# EAGLE design Sur control (EAGLE 8.7.0)
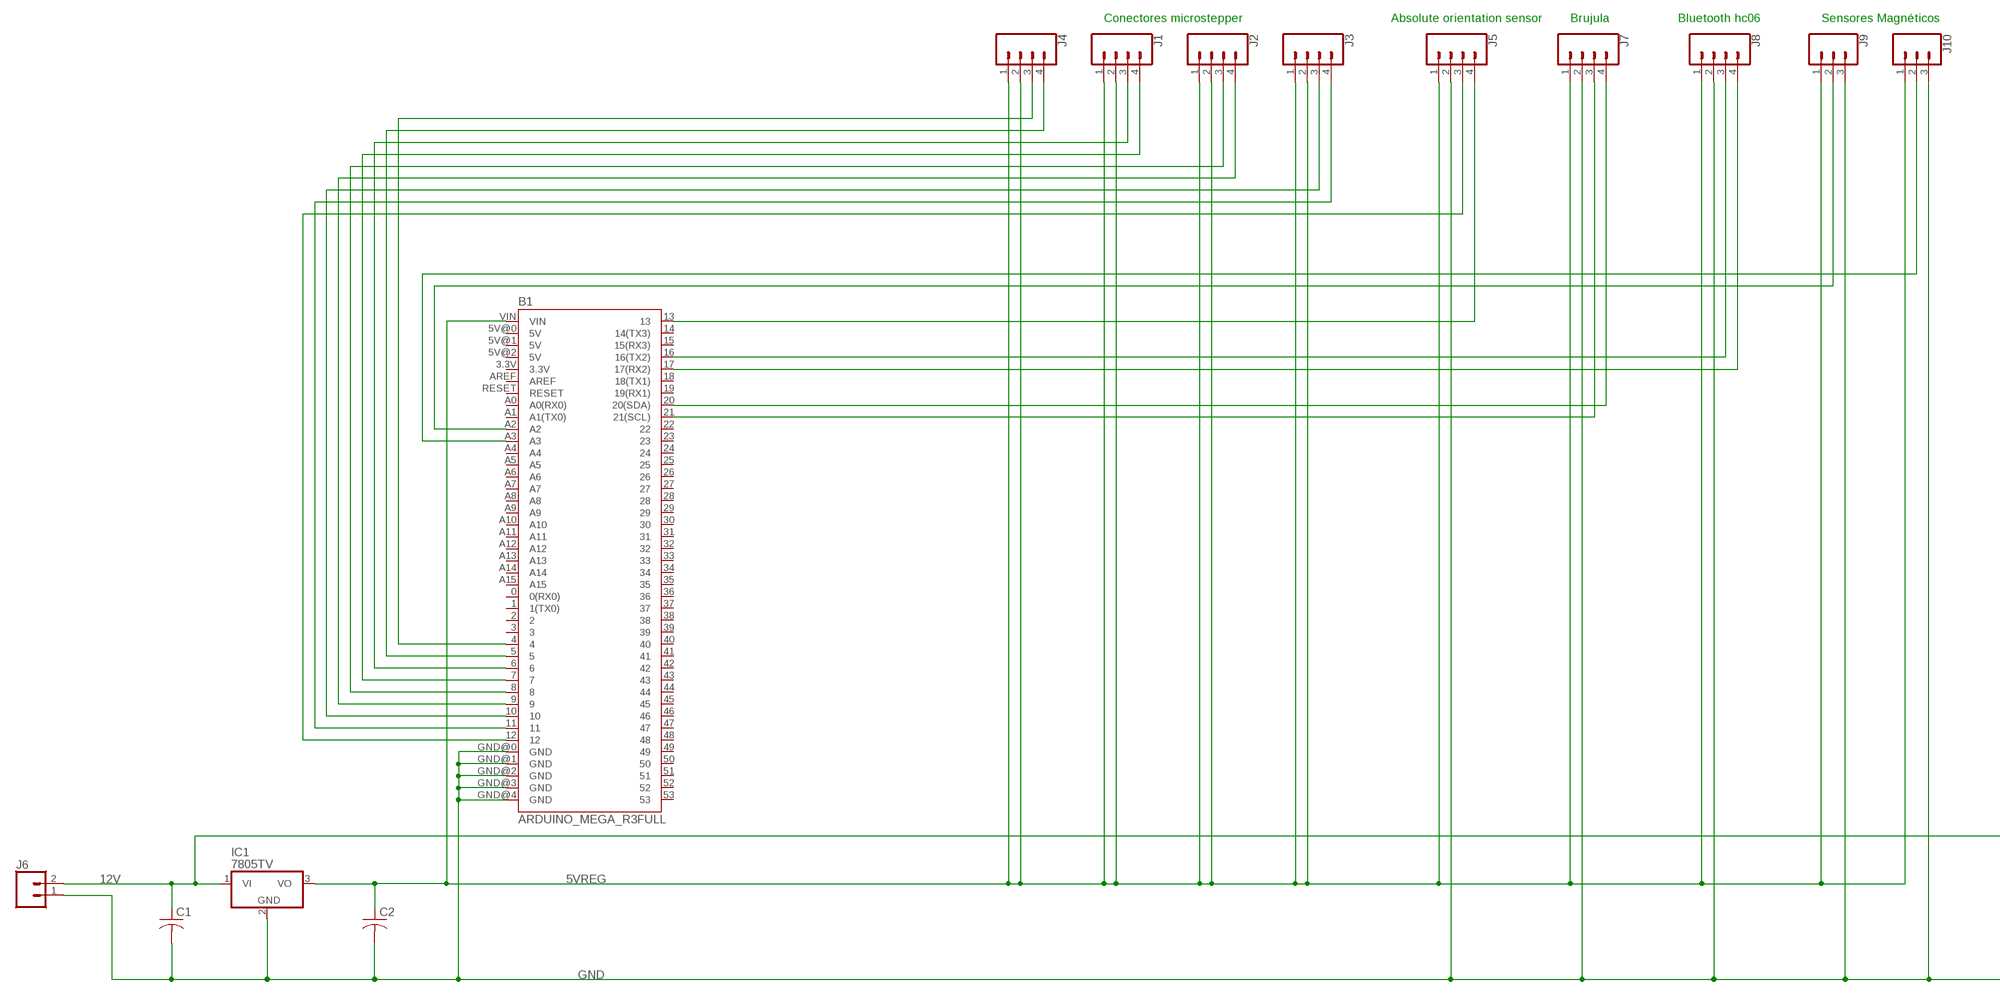
[diagram p0: schematic, sheet 1, part 1 of 2]
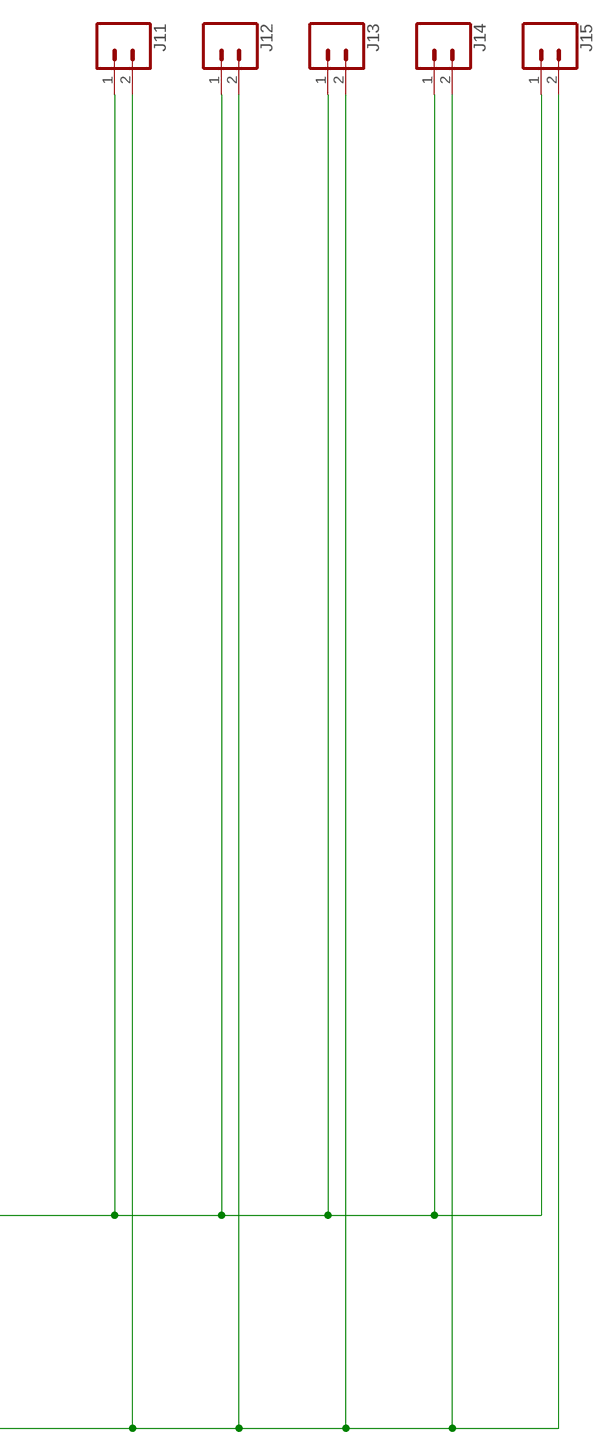
[diagram p1: schematic, sheet 1, part 2 of 2]

## Parts
B1  ARDUINO_MEGA_R3FULL  [ARDUINO_MEGA]
C1  C-US050-025X075  [C050-025X075]
C2  C-US050-025X075  [C050-025X075]
IC1  7805TV  [TO220V]
J1  CONN_04SCREW_LOCK  [SCREWTERMINAL-3.5MM-4_LOCK]
J2  CONN_04SCREW_LOCK  [SCREWTERMINAL-3.5MM-4_LOCK]
J3  CONN_04SCREW_LOCK  [SCREWTERMINAL-3.5MM-4_LOCK]
J4  CONN_04SCREW_LOCK  [SCREWTERMINAL-3.5MM-4_LOCK]
J5  CONN_04SCREW_LOCK  [SCREWTERMINAL-3.5MM-4_LOCK]
J6  CONN_023.5MM_LOCK  [SCREWTERMINAL-3.5MM-2_LOCK]
J7  CONN_04SCREW_LOCK  [SCREWTERMINAL-3.5MM-4_LOCK]
J8  CONN_04SCREW_LOCK  [SCREWTERMINAL-3.5MM-4_LOCK]
J9  CONN_03SCREW_LOCK  [SCREWTERMINAL-3.5MM-3_LOCK.007S]
J10  CONN_03SCREW_LOCK  [SCREWTERMINAL-3.5MM-3_LOCK.007S]
J11  CONN_023.5MM_LOCK  [SCREWTERMINAL-3.5MM-2_LOCK]
J12  CONN_023.5MM_LOCK  [SCREWTERMINAL-3.5MM-2_LOCK]
J13  CONN_023.5MM_LOCK  [SCREWTERMINAL-3.5MM-2_LOCK]
J14  CONN_023.5MM_LOCK  [SCREWTERMINAL-3.5MM-2_LOCK]
J15  CONN_023.5MM_LOCK  [SCREWTERMINAL-3.5MM-2_LOCK]

## Nets
5VREG: B1.VIN C2.1 IC1.3(VO) J1.1 J1.2 J2.1 J2.2 J3.1 J3.2 J4.1 J4.2 J5.1 J7.1 J8.1 J9.1 J10.1
12V: C1.1 IC1.1(VI) J6.2 J11.1 J12.1 J13.1 J14.1 J15.1
GND: B1.GND@0(GND) B1.GND@1(GND) B1.GND@2(GND) B1.GND@3(GND) B1.GND@4(GND) C1.2 C2.2 IC1.2(GND) J5.2 J6.1 J7.2 J8.2 J9.3 J10.3 J11.2 J12.2 J13.2 J14.2 J15.2
N$1: B1.21(21(SCL)) J7.3
N$2: B1.20(20(SDA)) J7.4
N$4: B1.4 J4.3
N$5: B1.5 J4.4
N$6: B1.6 J1.3
N$7: B1.7 J1.4
N$8: B1.8 J2.3
N$9: B1.9 J2.4
N$10: B1.10 J3.3
N$11: B1.11 J3.4
N$12: B1.12 J5.3
N$13: B1.13 J5.4
N$16: B1.16(16(TX2)) J8.3
N$17: B1.17(17(RX2)) J8.4
N$18: B1.A2 J9.2
N$19: B1.A3 J10.2
Unconnected: B1.0(0(RX0)) B1.1(1(TX0)) B1.2 B1.3 B1.3.3V B1.5V@0(5V) B1.5V@1(5V) B1.5V@2(5V) B1.14(14(TX3)) B1.15(15(RX3)) B1.18(18(TX1)) B1.19(19(RX1)) B1.22 B1.23 B1.24 B1.25 B1.26 B1.27 B1.28 B1.29 B1.30 B1.31 B1.32 B1.33 B1.34 B1.35 B1.36 B1.37 B1.38 B1.39 B1.40 B1.41 B1.42 B1.43 B1.44 B1.45 B1.46 B1.47 B1.48 B1.49 B1.50 B1.51 B1.52 B1.53 B1.A0(A0(RX0)) B1.A1(A1(TX0)) B1.A4 B1.A5 B1.A6 B1.A7 B1.A8 B1.A9 B1.A10 B1.A11 B1.A12 B1.A13 B1.A14 B1.A15 B1.AREF B1.RESET

## Notes on the sheet
- Conectores microstepper | Absolute orientation sensor | Brujula | Bluetooth hc06 | Sensores Magnéticos

## Library data of the parts
B1 = SparkFun-Boards:ARDUINO_MEGA_R3: Arduino Mega R3 ATmega2560 R3 compatible footprint. SparkFun Products: Arduino Mega 2560 R3 <https://www.sparkfun.com/products/11061>
C1 C2 = rcl:C-US: CAPACITOR, American symbol; SPICEPREFIX: C
IC1 = linear:78*: Positive VOLTAGE REGULATOR Source: http://cache.national.com/ds/LM/LM78L05.pdf http://www.fairchildsemi.com/ds/LM/LM7805.pdf
J1-J5 J7 J8 = SparkFun-Connectors:CONN_04: Multi connection point. Often used as Generic Header-pin footprint for 0.1 inch spaced/style header connections On any of the 0.1 inch spaced packages, you can populate with these: Break Away Headers - Straight <https://www.sparkfun.com/products/116> (PRT-00116) Break Away Male Headers - Right Angle <https://www.sparkfun.com/products/553> (PRT-00553) Female Headers <https://www.sparkfun.com/products/115> (PRT-00115) Break Away Headers - Machine Pin <https://www.sparkfun.com/products/117> (PRT-00117) Break Away Female Headers - Swiss Machine Pin <https://www.sparkfun.com/products/743> (PRT-00743) For SCREWTERMINALS and SPRING TERMINALS visit here: Screw Terimnals on SparkFun.com <https://www.sparkfun.com/search/results?term=Screw+Terminals> (5mm/3.5mm/2.54mm spacing) This device is also useful as a general connection point to wire up your design to another part of your project. Our various solder wires solder well into these plated through hole pads. Hook-Up Wire - Assortment (Stranded, 22 AWG) <https://www.sparkfun.com/products/11375> (PRT-11375) Hook-Up Wire - Assortment (Solid Core, 22 AWG) <https://www.sparkfun.com/products/11367> (PRT-11367) View the entire wire category on our website here <https://www.sparkfun.com/categories/141> Special notes: Molex polarized connector foot print use with SKU : PRT-08231 with associated crimp pins and housings. 1MM SMD Version SKU: PRT-10208
J6 J11-J15 = SparkFun-Connectors:CONN_02: Multi connection point. Often used as Generic Header-pin footprint for 0.1 inch spaced/style header connections On any of the 0.1 inch spaced packages, you can populate with these: Break Away Headers - Straight <https://www.sparkfun.com/products/116> (PRT-00116) Break Away Male Headers - Right Angle <https://www.sparkfun.com/products/553> (PRT-00553) Female Headers <https://www.sparkfun.com/products/115> (PRT-00115) Break Away Headers - Machine Pin <https://www.sparkfun.com/products/117> (PRT-00117) Break Away Female Headers - Swiss Machine Pin <https://www.sparkfun.com/products/743> (PRT-00743) For SCREWTERMINALS and SPRING TERMINALS visit here: Screw Terimnals on SparkFun.com <https://www.sparkfun.com/search/results?term=Screw+Terminals> (5mm/3.5mm/2.54mm spacing) This device is also useful as a general connection point to wire up your design to another part of your project. Our various solder wires solder well into these plated through hole pads. Hook-Up Wire - Assortment (Stranded, 22 AWG) <https://www.sparkfun.com/products/11375> (PRT-11375) Hook-Up Wire - Assortment (Solid Core, 22 AWG) <https://www.sparkfun.com/products/11367> (PRT-11367) View the entire wire category on our website here <https://www.sparkfun.com/categories/141> Special notes: Molex polarized connector foot print use with: PRT-08233 with associated crimp pins and housings. 2.54_SCREWTERM for use with PRT-10571. 3.5mm Screw Terminal footprints for PRT-08084 5mm Screw Terminal footprints for use with PRT-08432; PROD_ID: CONN-08399
J9 J10 = SparkFun-Connectors:CONN_03: Multi connection point. Often used as Generic Header-pin footprint for 0.1 inch spaced/style header connections On any of the 0.1 inch spaced packages, you can populate with these: Break Away Headers - Straight <https://www.sparkfun.com/products/116> (PRT-00116) Break Away Male Headers - Right Angle <https://www.sparkfun.com/products/553> (PRT-00553) Female Headers <https://www.sparkfun.com/products/115> (PRT-00115) Break Away Headers - Machine Pin <https://www.sparkfun.com/products/117> (PRT-00117) Break Away Female Headers - Swiss Machine Pin <https://www.sparkfun.com/products/743> (PRT-00743) Stackable Header - 3 Pin (Female, 0.1") <https://www.sparkfun.com/products/13875> (PRT-13875) For SCREWTERMINALS and SPRING TERMINALS visit here: Screw Terimnals on SparkFun.com <https://www.sparkfun.com/search/results?term=Screw+Terminals> (5mm/3.5mm/2.54mm spacing) This device is also useful as a general connection point to wire up your design to another part of your project. Our various solder wires solder well into these plated through hole pads. Hook-Up Wire - Assortment (Stranded, 22 AWG) <https://www.sparkfun.com/products/11375> (PRT-11375) Hook-Up Wire - Assortment (Solid Core, 22 AWG) <https://www.sparkfun.com/products/11367> (PRT-11367) View the entire wire category on our website here <https://www.sparkfun.com/categories/141> Special notes: Molex polarized connector foot print use with SKU : PRT-08232 with associated crimp pins and housings.; PROD_ID: CONN-08288; SF_ID: PRT-08235

## Board
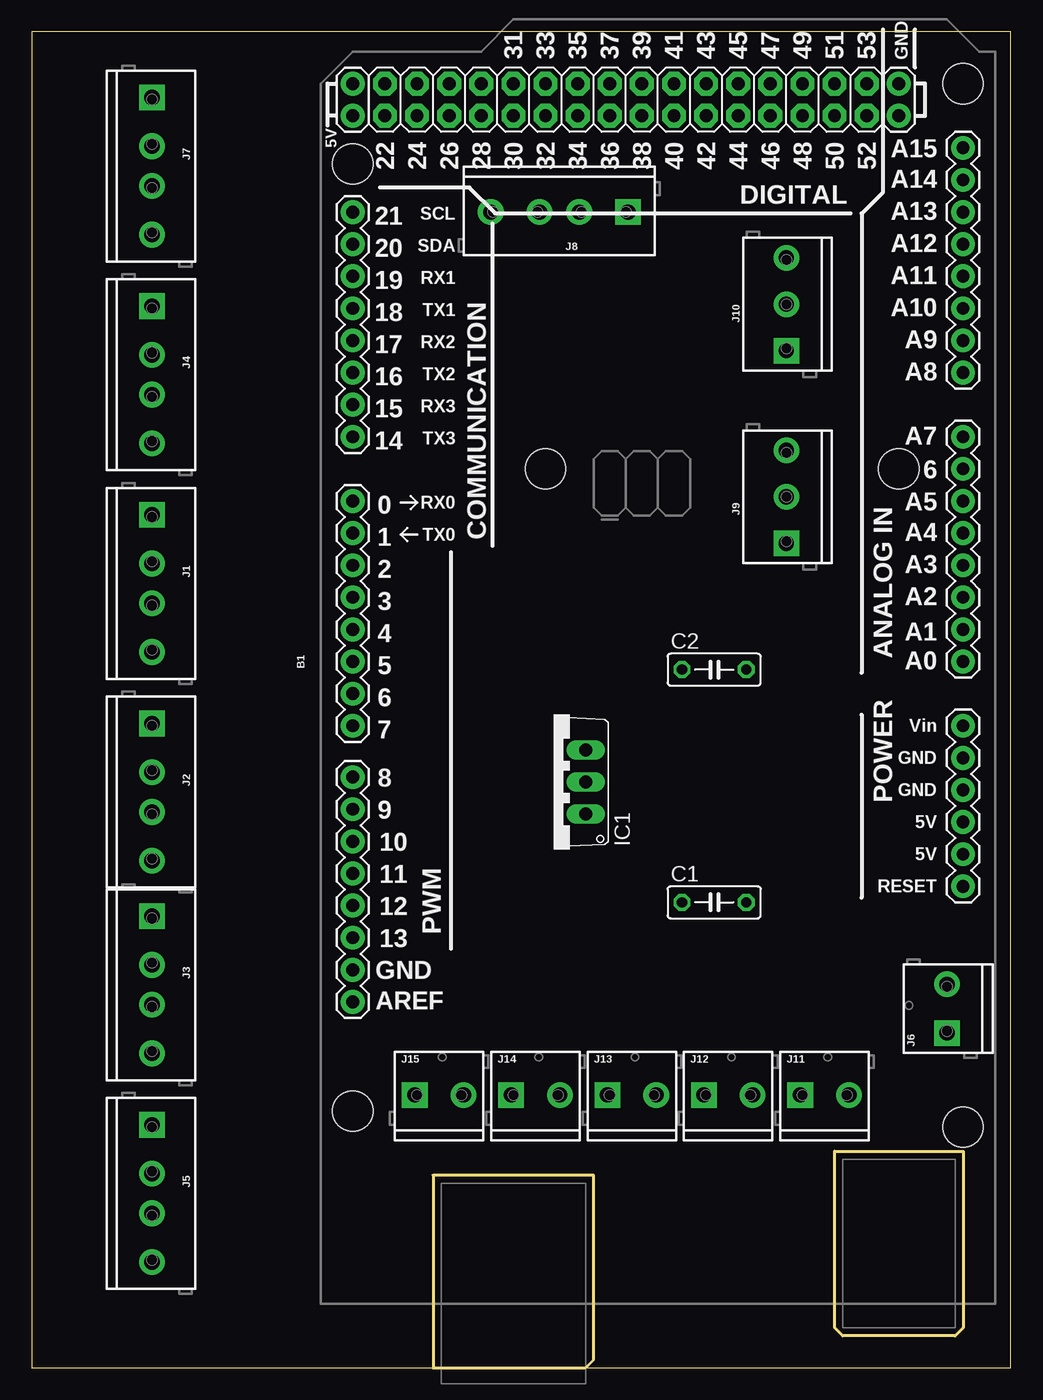
[diagram p2: board, top side]
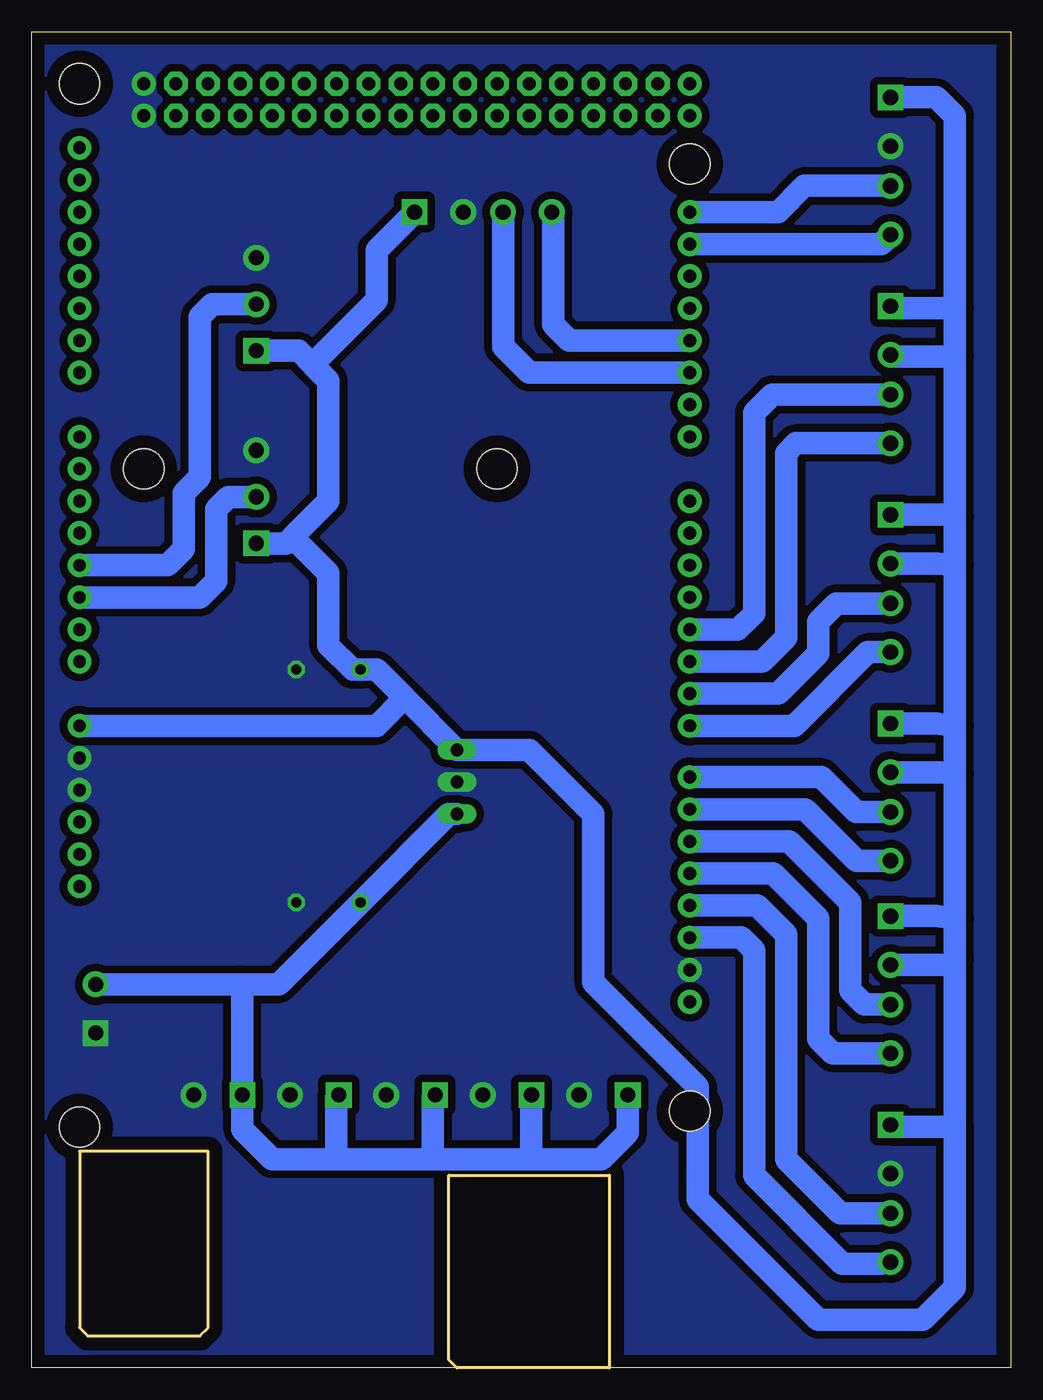
[diagram p3: board, bottom side, seen from below]

Size 77.45 x 105.72 mm. Coordinates in mm from the lower left corner, seen from the top.
Outline: 0,0 77.45,0 77.45,105.72 0,105.72 0,0
Copper layers (1*16): Top 0.035mm / dielectric 1.5mm / Bottom 0.035mm
Design rules "default": minimum track width 6mil, minimum drill 0.35mm, track to track 6mil, track to pad 6mil, pad to pad 6mil, via to via 6mil, smd to smd 6mil, copper to edge 40mil, drill to drill 6mil, minimum pad ring 10mil, minimum via ring 8mil, stop-mask expansion 4mil, vias tented up to drill 0mil, thermal gap 10mil

### Footprints (pad centres in the part's own frame; a part is rotated, then mirrored left to right if it is on the bottom)
ARDUINO_MEGA = drill 1.016 pad 1.88: 0 13.97,24.13; 1 11.43,24.13; 2 8.89,24.13; 3 6.35,24.13; 3.3V -13.97,-24.13; 4 3.81,24.13; 5 1.27,24.13; 5V@0 -11.43,-24.13; 5V@1 44.45,24.13; 5V@2 46.99,24.13; 6 -1.27,24.13; 7 -3.81,24.13; 8 -7.874,24.13; 9 -10.414,24.13; 10 -12.954,24.13; 11 -15.494,24.13; 12 -18.034,24.13; 13 -20.574,24.13; 14 19.05,24.13; 15 21.59,24.13; 16 24.13,24.13; 17 26.67,24.13; 18 29.21,24.13; 19 31.75,24.13; 20 34.29,24.13; 21 36.83,24.13; A0 1.27,-24.13; A1 3.81,-24.13; A2 6.35,-24.13; A3 8.89,-24.13; A4 11.43,-24.13; A5 13.97,-24.13; A6 16.51,-24.13; A7 19.05,-24.13; A8 24.13,-24.13; A9 26.67,-24.13; A10 29.21,-24.13; A11 31.75,-24.13; A12 34.29,-24.13; A13 36.83,-24.13; A14 39.37,-24.13; A15 41.91,-24.13; AREF -25.654,24.13; GND@0 -8.89,-24.13; GND@1 -6.35,-24.13; GND@2 44.45,-19.05; GND@3 46.99,-19.05; GND@4 -23.114,24.13; RESET -16.51,-24.13; VIN -3.81,-24.13 | drill 1.016 pad 1.88 octagon: 22 44.45,21.59; 23 46.99,21.59; 24 44.45,19.05; 25 46.99,19.05; 26 44.45,16.51; 27 46.99,16.51; 28 44.45,13.97; 29 46.99,13.97; 30 44.45,11.43; 31 46.99,11.43; 32 44.45,8.89; 33 46.99,8.89; 34 44.45,6.35; 35 46.99,6.35; 36 44.45,3.81; 37 46.99,3.81; 38 44.45,1.27; 39 46.99,1.27; 40 44.45,-1.27; 41 46.99,-1.27; 42 44.45,-3.81; 43 46.99,-3.81; 44 44.45,-6.35; 45 46.99,-6.35; 46 44.45,-8.89; 47 46.99,-8.89; 48 44.45,-11.43; 49 46.99,-11.43; 50 44.45,-13.97; 51 46.99,-13.97; 52 44.45,-16.51; 53 46.99,-16.51 | hole 3.2: -34.29,24.13; -35.56,-24.13; 16.51,8.89; 16.51,-19.05; 40.64,24.13; 46.99,-24.13
C050-025X075 = drill 0.813 octagon: 1 -2.54,0; 2 2.54,0
TO220V = drill 1.016 long: 1 -2.54,-2.54; 2 0,-2.54; 3 2.54,-2.54
SCREWTERMINAL-3.5MM-4_LOCK = drill 1.2 pad 2.032 square: 1 -0.178,0 | drill 1.2 pad 2.032: 2 3.678,0; 3 6.822,0; 4 10.678,0
SCREWTERMINAL-3.5MM-2_LOCK = drill 1.2 pad 2.032 square: 1 -0.178,0 | drill 1.2 pad 2.032: 2 3.678,0
SCREWTERMINAL-3.5MM-3_LOCK.007S = drill 1.2 pad 2.032 square: 1 -0.178,0 | drill 1.2 pad 2.032: 2 3.5,0; 3 7.178,0

### Placement (x,y rotation side)
B1  49.53,54.61 90 top
C1  53.98,36.83 0 top
C2  53.98,55.24 0 top
IC1  41.27,46.35 90 top
J1  9.53,67.31 270 top
J2  9.53,50.8 270 top
J3  9.53,35.56 270 top
J4  9.53,83.82 270 top
J5  9.53,19.05 270 top
J6  72.39,26.67 90 top
J7  9.53,100.33 270 top
J8  46.99,91.44 180 top
J9  59.69,65.41 90 top
J10  59.69,80.64 90 top
J11  60.96,21.59 0 top
J12  53.34,21.59 0 top
J13  45.72,21.59 0 top
J14  38.1,21.59 0 top
J15  30.48,21.59 0 top

### Tracks (layer width: path | path; a pad name or v marks a point on that pad's centre or on a via)
5VREG
  Bottom 1.778: 47.94,53.02 IC1.3 38.1,48.89 33.02,43.81 33.02,30.48 24.77,22.23 24.77,13.34 15.24,3.81 6.98,3.81 4.45,6.35 4.45,19.05 | 47.94,53.02 50.16,55.24 C2.1 52.07,55.24 53.98,57.15 53.98,62.86 56.83,65.72 | B1.VIN 50.16,50.8 47.94,53.02 | J10.1 56.34,80.47 55.25,79.38 | 55.25,79.38 53.98,78.11 53.98,68.58 56.83,65.72 | J9.1 57.33,65.23 56.83,65.72 | J8.1 50.16,88.44 50.16,84.45 55.25,79.38 | J5.1 9.35,19.05 4.45,19.05 | 4.45,19.05 4.45,32.38 | 4.45,32.38 4.45,35.56 | 4.45,35.56 4.45,46.99 | 4.45,46.99 4.45,50.8 | 4.45,50.8 4.45,63.5 | 4.45,63.5 4.45,67.31 | 4.45,67.31 4.45,80.01 | 4.45,80.01 4.45,83.82 | 4.45,83.82 4.45,99.06 5.89,100.51 J7.1 | J4.1 9.35,83.82 4.45,83.82 | J4.2 9.39,80.01 4.45,80.01 | J1.1 4.62,67.49 4.45,67.31 | J1.2 5.85,63.63 4.45,63.5 | J2.1 5.89,50.98 4.45,50.8 | J2.2 4.58,47.12 4.45,46.99 | J3.1 5.89,35.74 4.45,35.56 | J3.2 4.95,31.88 4.45,32.38
12V
  Bottom 1.778: IC1.1 44.45,43.81 C1.1 57.92,30.35 60.96,30.35 | J15.1 30.3,18.59 32.39,16.51 38.1,16.51 | 38.1,16.51 45.72,16.51 | 45.72,16.51 53.34,16.51 | 53.34,16.51 58.42,16.51 60.78,18.87 J11.1 60.78,30.17 60.96,30.35 | J12.1 53.34,21.41 53.34,16.51 | J13.1 45.72,21.41 45.72,16.51 | J14.1 37.92,16.69 38.1,16.51 | J6.2 60.96,30.35
GND
  pour Bottom (isolate 0.61, no thermals): 78.11,106.05 2.54,106.05 1.27,104.77 1.27,-0.63 78.11,-0.63
N$1
  Bottom 1.778: J7.3 16.35,93.51 18.41,91.44 B1.21
N$2
  Bottom 1.778: J7.4 10.28,88.9 B1.20
N$4
  Bottom 1.778: B1.4 21.59,58.42 20.32,59.69 20.32,75.56 18.89,77 J4.3
N$5
  Bottom 1.778: J4.4 17.03,73.14 17.78,72.39 17.78,57.78 19.69,55.88 B1.5
N$6
  Bottom 1.778: J1.3 13.81,60.49 15.24,59.05 15.24,56.52 18.41,53.34 B1.6
N$7
  Bottom 1.778: J1.4 11.31,56.63 17.15,50.8 B1.7
N$8
  Bottom 1.778: J2.3 12.23,43.98 14.99,46.74 B1.8
N$9
  Bottom 1.778: J2.4 12.18,40.12 16.26,44.2 B1.9
N$10
  Bottom 1.778: J3.3 11.59,28.74 12.7,29.84 12.7,36.83 17.53,41.66 B1.10
N$11
  Bottom 1.778: J3.4 14.09,24.88 15.24,26.03 15.24,35.56 18.8,39.12 B1.11
N$12
  Bottom 1.778: J5.3 13.5,12.23 17.78,16.51 17.78,34.29 20.07,36.58 B1.12
N$13
  Bottom 1.778: B1.13 21.34,34.04 20.32,33.02 20.32,15.24 13.33,8.25 10.28,8.25 J5.4
N$16
  Bottom 1.778: B1.16 38.1,78.74 40.17,80.81 J8.3
N$17
  Bottom 1.778: B1.17 34.93,81.28 36.2,82.55 36.2,91.32 J8.4
N$18
  Bottom 1.778: J9.2 61.91,68.91 62.86,67.95 62.86,62.23 64.14,60.96 B1.A2
N$19
  Bottom 1.778: B1.A3 66.67,63.5 65.41,64.77 65.41,69.22 64.14,70.48 64.14,83.19 63.17,84.14 J10.2